# EAGLE design M7103 (EAGLE 6.6.0)
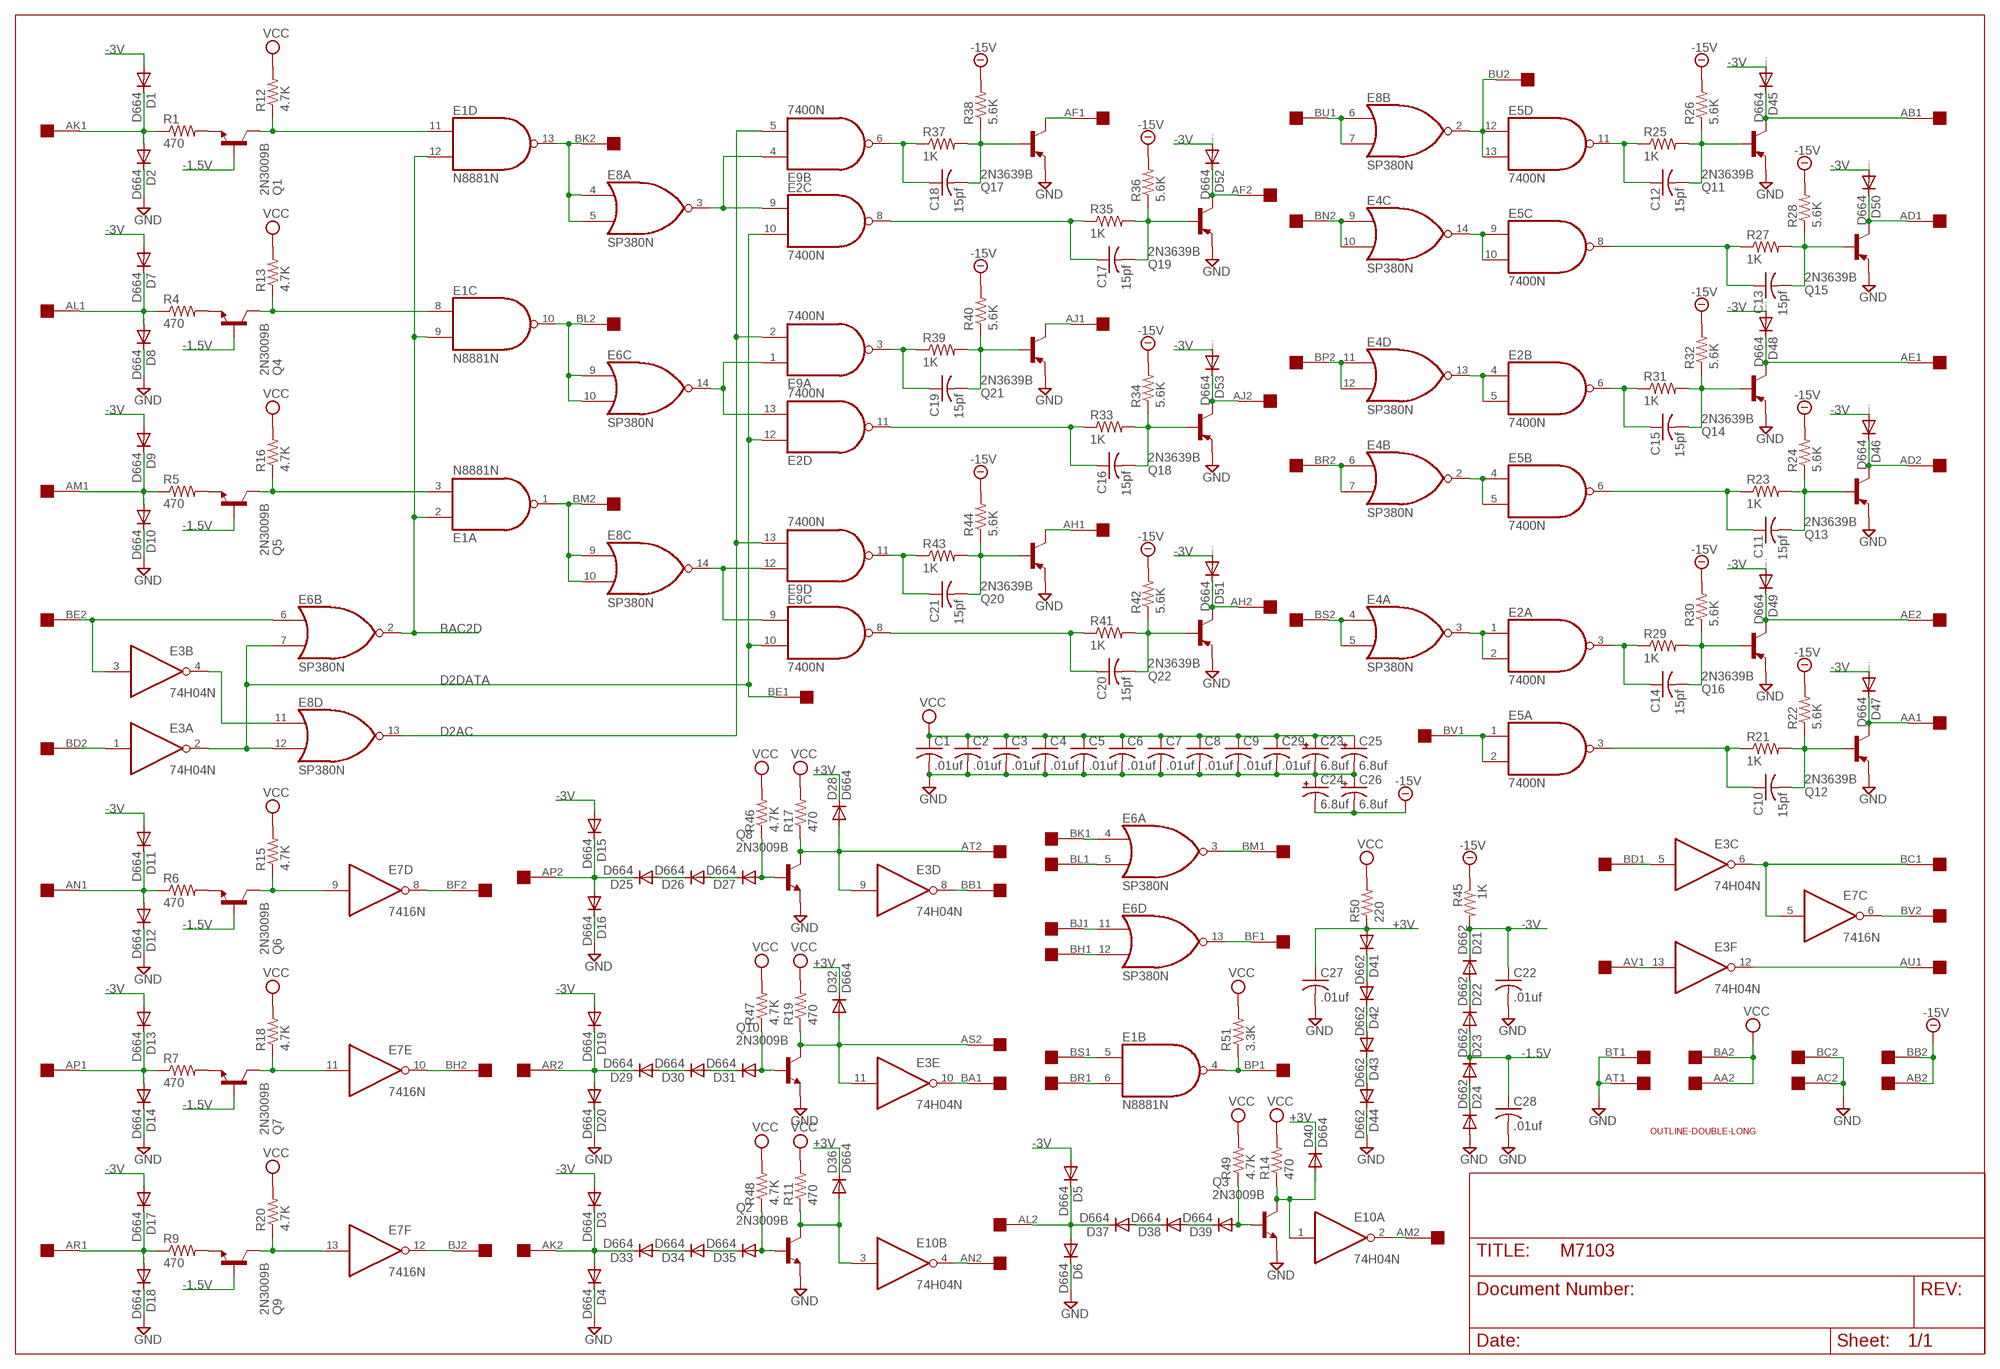
[diagram p0: schematic, sheet 1]

## Parts
C1  .01uf  C-US050-025X075  [C050-025X075]
C2  .01uf  C-US050-025X075  [C050-025X075]
C3  .01uf  C-US050-025X075  [C050-025X075]
C4  .01uf  C-US050-025X075  [C050-025X075]
C5  .01uf  C-US050-025X075  [C050-025X075]
C6  .01uf  C-US050-025X075  [C050-025X075]
C7  .01uf  C-US050-025X075  [C050-025X075]
C8  .01uf  C-US050-025X075  [C050-025X075]
C9  .01uf  C-US050-025X075  [C050-025X075]
C10  15pf  C-US050-025X075  [C050-025X075]
C11  15pf  C-US050-025X075  [C050-025X075]
C12  15pf  C-US050-025X075  [C050-025X075]
C13  15pf  C-US050-025X075  [C050-025X075]
C14  15pf  C-US050-025X075  [C050-025X075]
C15  15pf  C-US050-025X075  [C050-025X075]
C16  15pf  C-US050-025X075  [C050-025X075]
C17  15pf  C-US050-025X075  [C050-025X075]
C18  15pf  C-US050-025X075  [C050-025X075]
C19  15pf  C-US050-025X075  [C050-025X075]
C20  15pf  C-US050-025X075  [C050-025X075]
C21  15pf  C-US050-025X075  [C050-025X075]
C22  .01uf  C-US050-025X075  [C050-025X075]
C23  6.8uf  CPOL-USE15-5AXIAL  [E15-5]
C24  6.8uf  CPOL-USE15-5AXIAL  [E15-5]
C25  6.8uf  CPOL-USE15-5AXIAL  [E15-5]
C26  6.8uf  CPOL-USE15-5AXIAL  [E15-5]
C27  .01uf  C-US050-025X075  [C050-025X075]
C28  .01uf  C-US050-025X075  [C050-025X075]
C29  .01uf  C-US050-025X075  [C050-025X075]
D1  D664  1N4148DO35-10  [DO35-10]
D2  D664  1N4148DO35-10  [DO35-10]
D3  D664  1N4148DO35-10  [DO35-10]
D4  D664  1N4148DO35-10  [DO35-10]
D5  D664  1N4148DO35-10  [DO35-10]
D6  D664  1N4148DO35-10  [DO35-10]
D7  D664  1N4148DO35-10  [DO35-10]
D8  D664  1N4148DO35-10  [DO35-10]
D9  D664  1N4148DO35-10  [DO35-10]
D10  D664  1N4148DO35-10  [DO35-10]
D11  D664  1N4148DO35-10  [DO35-10]
D12  D664  1N4148DO35-10  [DO35-10]
D13  D664  1N4148DO35-10  [DO35-10]
D14  D664  1N4148DO35-10  [DO35-10]
D15  D664  1N4148DO35-10  [DO35-10]
D16  D664  1N4148DO35-10  [DO35-10]
D17  D664  1N4148DO35-10  [DO35-10]
D18  D664  1N4148DO35-10  [DO35-10]
D19  D664  1N4148DO35-10  [DO35-10]
D20  D664  1N4148DO35-10  [DO35-10]
D21  D662  1N4148DO35-10  [DO35-10]
D22  D662  1N4148DO35-10  [DO35-10]
D23  D662  1N4148DO35-10  [DO35-10]
D24  D662  1N4148DO35-10  [DO35-10]
D25  D664  1N4148DO35-10  [DO35-10]
D26  D664  1N4148DO35-10  [DO35-10]
D27  D664  1N4148DO35-10  [DO35-10]
D28  D664  1N4148DO35-10  [DO35-10]
D29  D664  1N4148DO35-10  [DO35-10]
D30  D664  1N4148DO35-10  [DO35-10]
D31  D664  1N4148DO35-10  [DO35-10]
D32  D664  1N4148DO35-10  [DO35-10]
D33  D664  1N4148DO35-10  [DO35-10]
D34  D664  1N4148DO35-10  [DO35-10]
D35  D664  1N4148DO35-10  [DO35-10]
D36  D664  1N4148DO35-10  [DO35-10]
D37  D664  1N4148DO35-10  [DO35-10]
D38  D664  1N4148DO35-10  [DO35-10]
D39  D664  1N4148DO35-10  [DO35-10]
D40  D664  1N4148DO35-10  [DO35-10]
D41  D662  1N4148DO35-10  [DO35-10]
D42  D662  1N4148DO35-10  [DO35-10]
D43  D662  1N4148DO35-10  [DO35-10]
D44  D662  1N4148DO35-10  [DO35-10]
D45  D664  1N4148DO35-10  [DO35-10]
D46  D664  1N4148DO35-10  [DO35-10]
D47  D664  1N4148DO35-10  [DO35-10]
D48  D664  1N4148DO35-10  [DO35-10]
D49  D664  1N4148DO35-10  [DO35-10]
D50  D664  1N4148DO35-10  [DO35-10]
D51  D664  1N4148DO35-10  [DO35-10]
D52  D664  1N4148DO35-10  [DO35-10]
D53  D664  1N4148DO35-10  [DO35-10]
E1  N8881N  [DIL14]
E2  7400N  [DIL14]
E3  74H04N  7404N  [DIL14]
E4  SP380N  [DIL14]
E5  7400N  [DIL14]
E6  SP380N  [DIL14]
E7  7416N  [DIL14]
E8  SP380N  [DIL14]
E9  7400N  [DIL14]
E10  74H04N  7404N  [DIL14]
EDGE  DOUBLE  [EDGE-CON4]
Q1  2N3009B  2N3019  [TO39]
Q2  2N3009B  2N3019  [TO39]
Q3  2N3009B  2N3019  [TO39]
Q4  2N3009B  2N3019  [TO39]
Q5  2N3009B  2N3019  [TO39]
Q6  2N3009B  2N3019  [TO39]
Q7  2N3009B  2N3019  [TO39]
Q8  2N3009B  2N3019  [TO39]
Q9  2N3009B  2N3019  [TO39]
Q10  2N3009B  2N3019  [TO39]
Q11  2N3639B  2N3637  [TO39]
Q12  2N3639B  2N3637  [TO39]
Q13  2N3639B  2N3637  [TO39]
Q14  2N3639B  2N3637  [TO39]
Q15  2N3639B  2N3637  [TO39]
Q16  2N3639B  2N3637  [TO39]
Q17  2N3639B  2N3637  [TO39]
Q18  2N3639B  2N3637  [TO39]
Q19  2N3639B  2N3637  [TO39]
Q20  2N3639B  2N3637  [TO39]
Q21  2N3639B  2N3637  [TO39]
Q22  2N3639B  2N3637  [TO39]
R1  470  R-US_0207/10  [0207/10]
R4  470  R-US_0207/10  [0207/10]
R5  470  R-US_0207/10  [0207/10]
R6  470  R-US_0207/10  [0207/10]
R7  470  R-US_0207/10  [0207/10]
R9  470  R-US_0207/10  [0207/10]
R11  470  R-US_0207/10  [0207/10]
R12  4.7K  R-US_0207/10  [0207/10]
R13  4.7K  R-US_0207/10  [0207/10]
R14  470  R-US_0207/10  [0207/10]
R15  4.7K  R-US_0207/10  [0207/10]
R16  4.7K  R-US_0207/10  [0207/10]
R17  470  R-US_0207/10  [0207/10]
R18  4.7K  R-US_0207/10  [0207/10]
R19  470  R-US_0207/10  [0207/10]
R20  4.7K  R-US_0207/10  [0207/10]
R21  1K  R-US_0207/10  [0207/10]
R22  5.6K  R-US_0207/10  [0207/10]
R23  1K  R-US_0207/10  [0207/10]
R24  5.6K  R-US_0207/10  [0207/10]
R25  1K  R-US_0207/10  [0207/10]
R26  5.6K  R-US_0207/10  [0207/10]
R27  1K  R-US_0207/10  [0207/10]
R28  5.6K  R-US_0207/10  [0207/10]
R29  1K  R-US_0207/10  [0207/10]
R30  5.6K  R-US_0207/10  [0207/10]
R31  1K  R-US_0207/10  [0207/10]
R32  5.6K  R-US_0207/10  [0207/10]
R33  1K  R-US_0207/10  [0207/10]
R34  5.6K  R-US_0207/10  [0207/10]
R35  1K  R-US_0207/10  [0207/10]
R36  5.6K  R-US_0207/10  [0207/10]
R37  1K  R-US_0207/10  [0207/10]
R38  5.6K  R-US_0207/10  [0207/10]
R39  1K  R-US_0207/10  [0207/10]
R40  5.6K  R-US_0207/10  [0207/10]
R41  1K  R-US_0207/10  [0207/10]
R42  5.6K  R-US_0207/10  [0207/10]
R43  1K  R-US_0207/10  [0207/10]
R44  5.6K  R-US_0207/10  [0207/10]
R45  1K  R-US_0207/10  [0207/10]
R46  4.7K  R-US_0207/10  [0207/10]
R47  4.7K  R-US_0207/10  [0207/10]
R48  4.7K  R-US_0207/10  [0207/10]
R49  4.7K  R-US_0207/10  [0207/10]
R50  220  R-US_0207/10  [0207/10]
R51  3.3K  R-US_0207/10  [0207/10]
U$3  OUTLINE-DOUBLE-LONG  [DOUBLE-LONG]

## Nets
+3V [Supply]: C27.1 D28.C D32.C D36.C D40.C D41.A R50.1
-1.5V [Supply]: C28.1 D22.A D23.C Q1.2(B) Q4.2(B) Q5.2(B) Q6.2(B) Q7.2(B) Q9.2(B)
-3V [Supply]: C22.1 D1.A D3.A D5.A D7.A D9.A D11.A D13.A D15.A D17.A D19.A D21.C D45.A D46.A D47.A D48.A D49.A D50.A D51.A D52.A D53.A R45.2
-15V [Supply]: C24.- C26.- EDGE.AB2 EDGE.BB2 R22.2 R24.2 R26.2 R28.2 R30.2 R32.2 R34.2 R36.2 R38.2 R40.2 R42.2 R44.2 R45.1
AK1: D1.C D2.A EDGE.AK1 R1.1
AL1: D7.C D8.A EDGE.AL1 R4.1
AM1: D9.C D10.A EDGE.AM1 R5.1
AN1: D11.C D12.A EDGE.AN1 R6.1
AP1: D13.C D14.A EDGE.AP1 R7.1
AR1: D17.C D18.A EDGE.AR1 R9.1
BAC2D: E1.2(A:I0) E1.9(C:I1) E1.12(D:I1) E6.2(B:O)
BD2: E3.1(A:I) EDGE.BD2
BE2: E3.3(B:I) E6.6(B:I0) EDGE.BE2
D2AC: E8.13(D:O) E9.2(A:I1) E9.5(B:I1) E9.13(D:I1)
D2DATA: E2.10(C:I1) E2.12(D:I0) E3.2(A:O) E6.7(B:I1) E8.12(D:I1) E9.10(C:I1) EDGE.BE1
GND [Supply]: C1.2 C2.2 C3.2 C4.2 C5.2 C6.2 C7.2 C8.2 C9.2 C22.2 C23.- C24.+ C25.- C26.+ C27.2 C28.2 C29.2 D2.C D4.C D6.C D8.C D10.C D12.C D14.C D16.C D18.C D20.C D24.A D44.C EDGE.AC2 EDGE.AT1 EDGE.BC2 EDGE.BT1 Q2.1(E) Q3.1(E) Q8.1(E) Q10.1(E) Q11.1(E) Q12.1(E) Q13.1(E) Q14.1(E) Q15.1(E) Q16.1(E) Q17.1(E) Q18.1(E) Q19.1(E) Q20.1(E) Q21.1(E) Q22.1(E)
N$1: Q4.1(E) R4.2
N$2: E1.8(C:I0) Q4.3(C) R13.1
N$3: Q1.1(E) R1.2
N$4: Q5.1(E) R5.2
N$5: E1.11(D:I0) Q1.3(C) R12.1
N$6: E1.3(A:I1) Q5.3(C) R16.1
N$7: Q6.1(E) R6.2
N$8: E7.9(D:I) Q6.3(C) R15.1
N$9: Q7.1(E) R7.2
N$10: E7.11(E:I) Q7.3(C) R18.1
N$11: Q9.1(E) R9.2
N$12: E7.13(F:I) Q9.3(C) R20.1
N$13: E3.4(B:O) E8.11(D:I0)
N$14: D15.C D16.A D25.C EDGE.AP2
N$15: E1.1(A:O) E8.9(C:I0) E8.10(C:I1) EDGE.BM2
N$16: E1.10(C:O) E6.9(C:I0) E6.10(C:I1) EDGE.BL2
N$17: E1.13(D:O) E8.4(A:I0) E8.5(A:I1) EDGE.BK2
N$18: E7.12(F:O) EDGE.BJ2
N$19: E7.10(E:O) EDGE.BH2
N$20: E7.8(D:O) EDGE.BF2
N$21: E2.9(C:I0) E8.3(A:O) E9.4(B:I0)
N$22: E2.13(D:I1) E6.14(C:O) E9.1(A:I0)
N$23: E8.14(C:O) E9.9(C:I0) E9.12(D:I0)
N$24: D27.A Q8.2(B) R46.1
N$25: D25.A D26.C
N$26: C18.1 E9.6(B:O) R37.1
N$27: C18.2 Q17.2(B) R37.2 R38.1
N$28: EDGE.AF1 Q17.3(C)
N$29: C17.1 E2.8(C:O) R35.1
N$30: C17.2 Q19.2(B) R35.2 R36.1
N$31: D52.C EDGE.AF2 Q19.3(C)
N$32: C12.1 E5.11(D:O) R25.1
N$33: C12.2 Q11.2(B) R25.2 R26.1
N$34: D45.C EDGE.AB1 Q11.3(C)
N$35: C13.1 E5.8(C:O) R27.1
N$36: C13.2 Q15.2(B) R27.2 R28.1
N$37: D50.C EDGE.AD1 Q15.3(C)
N$38: E5.12(D:I0) E5.13(D:I1) E8.2(B:O) EDGE.BU2
N$39: E4.14(C:O) E5.9(C:I0) E5.10(C:I1)
N$40: E8.6(B:I0) E8.7(B:I1) EDGE.BU1
N$41: E4.9(C:I0) E4.10(C:I1) EDGE.BN2
N$42: C19.1 E9.3(A:O) R39.1
N$43: C19.2 Q21.2(B) R39.2 R40.1
N$44: EDGE.AJ1 Q21.3(C)
N$45: C16.1 E2.11(D:O) R33.1
N$46: C16.2 Q18.2(B) R33.2 R34.1
N$47: D53.C EDGE.AJ2 Q18.3(C)
N$48: C21.1 E9.11(D:O) R43.1
N$49: C21.2 Q20.2(B) R43.2 R44.1
N$50: EDGE.AH1 Q20.3(C)
N$51: C20.1 E9.8(C:O) R41.1
N$52: C20.2 Q22.2(B) R41.2 R42.1
N$53: D51.C EDGE.AH2 Q22.3(C)
N$54: C15.1 E2.6(B:O) R31.1
N$55: C15.2 Q14.2(B) R31.2 R32.1
N$56: D48.C EDGE.AE1 Q14.3(C)
N$57: C11.1 E5.6(B:O) R23.1
N$58: C11.2 Q13.2(B) R23.2 R24.1
N$59: D46.C EDGE.AD2 Q13.3(C)
N$60: C14.1 E2.3(A:O) R29.1
N$61: C14.2 Q16.2(B) R29.2 R30.1
N$62: D49.C EDGE.AE2 Q16.3(C)
N$63: C10.1 E5.3(A:O) R21.1
N$64: C10.2 Q12.2(B) R21.2 R22.1
N$65: D47.C EDGE.AA1 Q12.3(C)
N$66: E2.4(B:I0) E2.5(B:I1) E4.13(D:O)
N$67: E4.2(B:O) E5.4(B:I0) E5.5(B:I1)
N$68: E5.1(A:I0) E5.2(A:I1) EDGE.BV1
N$69: E2.1(A:I0) E2.2(A:I1) E4.3(A:O)
N$70: E4.4(A:I0) E4.5(A:I1) EDGE.BS2
N$71: E4.6(B:I0) E4.7(B:I1) EDGE.BR2
N$72: E4.11(D:I0) E4.12(D:I1) EDGE.BP2
N$73: D26.A D27.C
N$74: D28.A E3.9(D:I) EDGE.AT2 Q8.3(C) R17.1
N$75: D31.A Q10.2(B) R47.1
N$76: D29.A D30.C
N$77: D30.A D31.C
N$78: D32.A E3.11(E:I) EDGE.AS2 Q10.3(C) R19.1
N$79: D35.A Q2.2(B) R48.1
N$80: D33.A D34.C
N$81: D34.A D35.C
N$82: D36.A E10.3(B:I) Q2.3(C) R11.1
N$83: D39.A Q3.2(B) R49.1
N$84: D37.A D38.C
N$85: D38.A D39.C
N$86: D40.A E10.1(A:I) Q3.3(C) R14.1
N$87: E10.4(B:O) EDGE.AN2
N$88: E3.8(D:O) EDGE.BB1
N$89: E3.10(E:O) EDGE.BA1
N$90: E10.2(A:O) EDGE.AM2
N$91: E6.5(A:I1) EDGE.BL1
N$92: E6.4(A:I0) EDGE.BK1
N$93: E6.3(A:O) EDGE.BM1
N$94: E6.13(D:O) EDGE.BF1
N$95: E6.12(D:I1) EDGE.BH1
N$96: E6.11(D:I0) EDGE.BJ1
N$97: E1.5(B:I0) EDGE.BS1
N$98: E1.6(B:I1) EDGE.BR1
N$99: E1.4(B:O) EDGE.BP1 R51.1
N$100: E3.6(C:O) E7.5(C:I) EDGE.BC1
N$101: E3.5(C:I) EDGE.BD1
N$102: E3.13(F:I) EDGE.AV1
N$103: E3.12(F:O) EDGE.AU1
N$104: E7.6(C:O) EDGE.BV2
N$105: D23.A D24.C
N$106: D3.C D4.A D33.C EDGE.AK2
N$107: D41.C D42.A
N$108: D42.C D43.A
N$109: D43.C D44.A
N$110: D21.A D22.C
N$111: D19.C D20.A D29.C EDGE.AR2
N$112: D5.C D6.A D37.C EDGE.AL2
VCC [Supply]: C1.1 C2.1 C3.1 C4.1 C5.1 C6.1 C7.1 C8.1 C9.1 C23.+ C25.+ C29.1 EDGE.AA2 EDGE.BA2 R11.2 R12.2 R13.2 R14.2 R15.2 R16.2 R17.2 R18.2 R19.2 R20.2 R46.2 R47.2 R48.2 R49.2 R50.2 R51.2
Unconnected: E7.1(A:I) E7.2(A:O) E7.3(B:I) E7.4(B:O) E10.5(C:I) E10.6(C:O) E10.8(D:O) E10.9(D:I) E10.10(E:O) E10.11(E:I) E10.12(F:O) E10.13(F:I) EDGE.AC1 EDGE.AS1 EDGE.AU2 EDGE.AV2 EDGE.BN1 EDGE.BT2

## Power pins joined to a net without a drawn wire
GND: E1.7(P:GND) E2.7(P:GND) E3.7(P:GND) E4.1(P:GND) E5.7(P:GND) E6.1(P:GND) E7.7(P:GND) E8.1(P:GND) E9.7(P:GND) E10.7(P:GND)
VCC: E1.14(P:VCC) E2.14(P:VCC) E3.14(P:VCC) E4.8(P:VCC) E5.14(P:VCC) E6.8(P:VCC) E7.14(P:VCC) E8.8(P:VCC) E9.14(P:VCC) E10.14(P:VCC)

## Library data of the parts
C1-C22 C27-C29 = rcl:C-US: CAPACITOR, American symbol
C23-C26 = rcl:CPOL-US: POLARIZED CAPACITOR, American symbol
D1-D53 = diode:1N4148: DIODE high speed (Philips)
E1 = dec-con:N8881: Quad 2-input NAND gate, open collector
E2 E5 E9 = 74xx-us:74*00: Quad 2-input NAND gate
E3 E10 = 74xx-us:74*04: Hex INVERTER
E4 E6 E8 = dec-con:SP380: Quad NOR gate (use 8640)
E7 = 74xx-us:74*16: Hex INVERTER, open collector, high-voltage
EDGE = dec-con:DOUBLE: Double-Height DEC board
Q1-Q10 = transistor-npn:2N3019: NPN Transistor
Q11-Q22 = transistor-pnp:2N3637*: PNP Transistror
R1 R4-R7 R9 R11-R51 = rcl:R-US_: RESISTOR, American symbol
U$3 = dec-con:OUTLINE-*: Board outlines for DEC boards.

## Net classes
1 Supply: width 0.635 mm

## Board
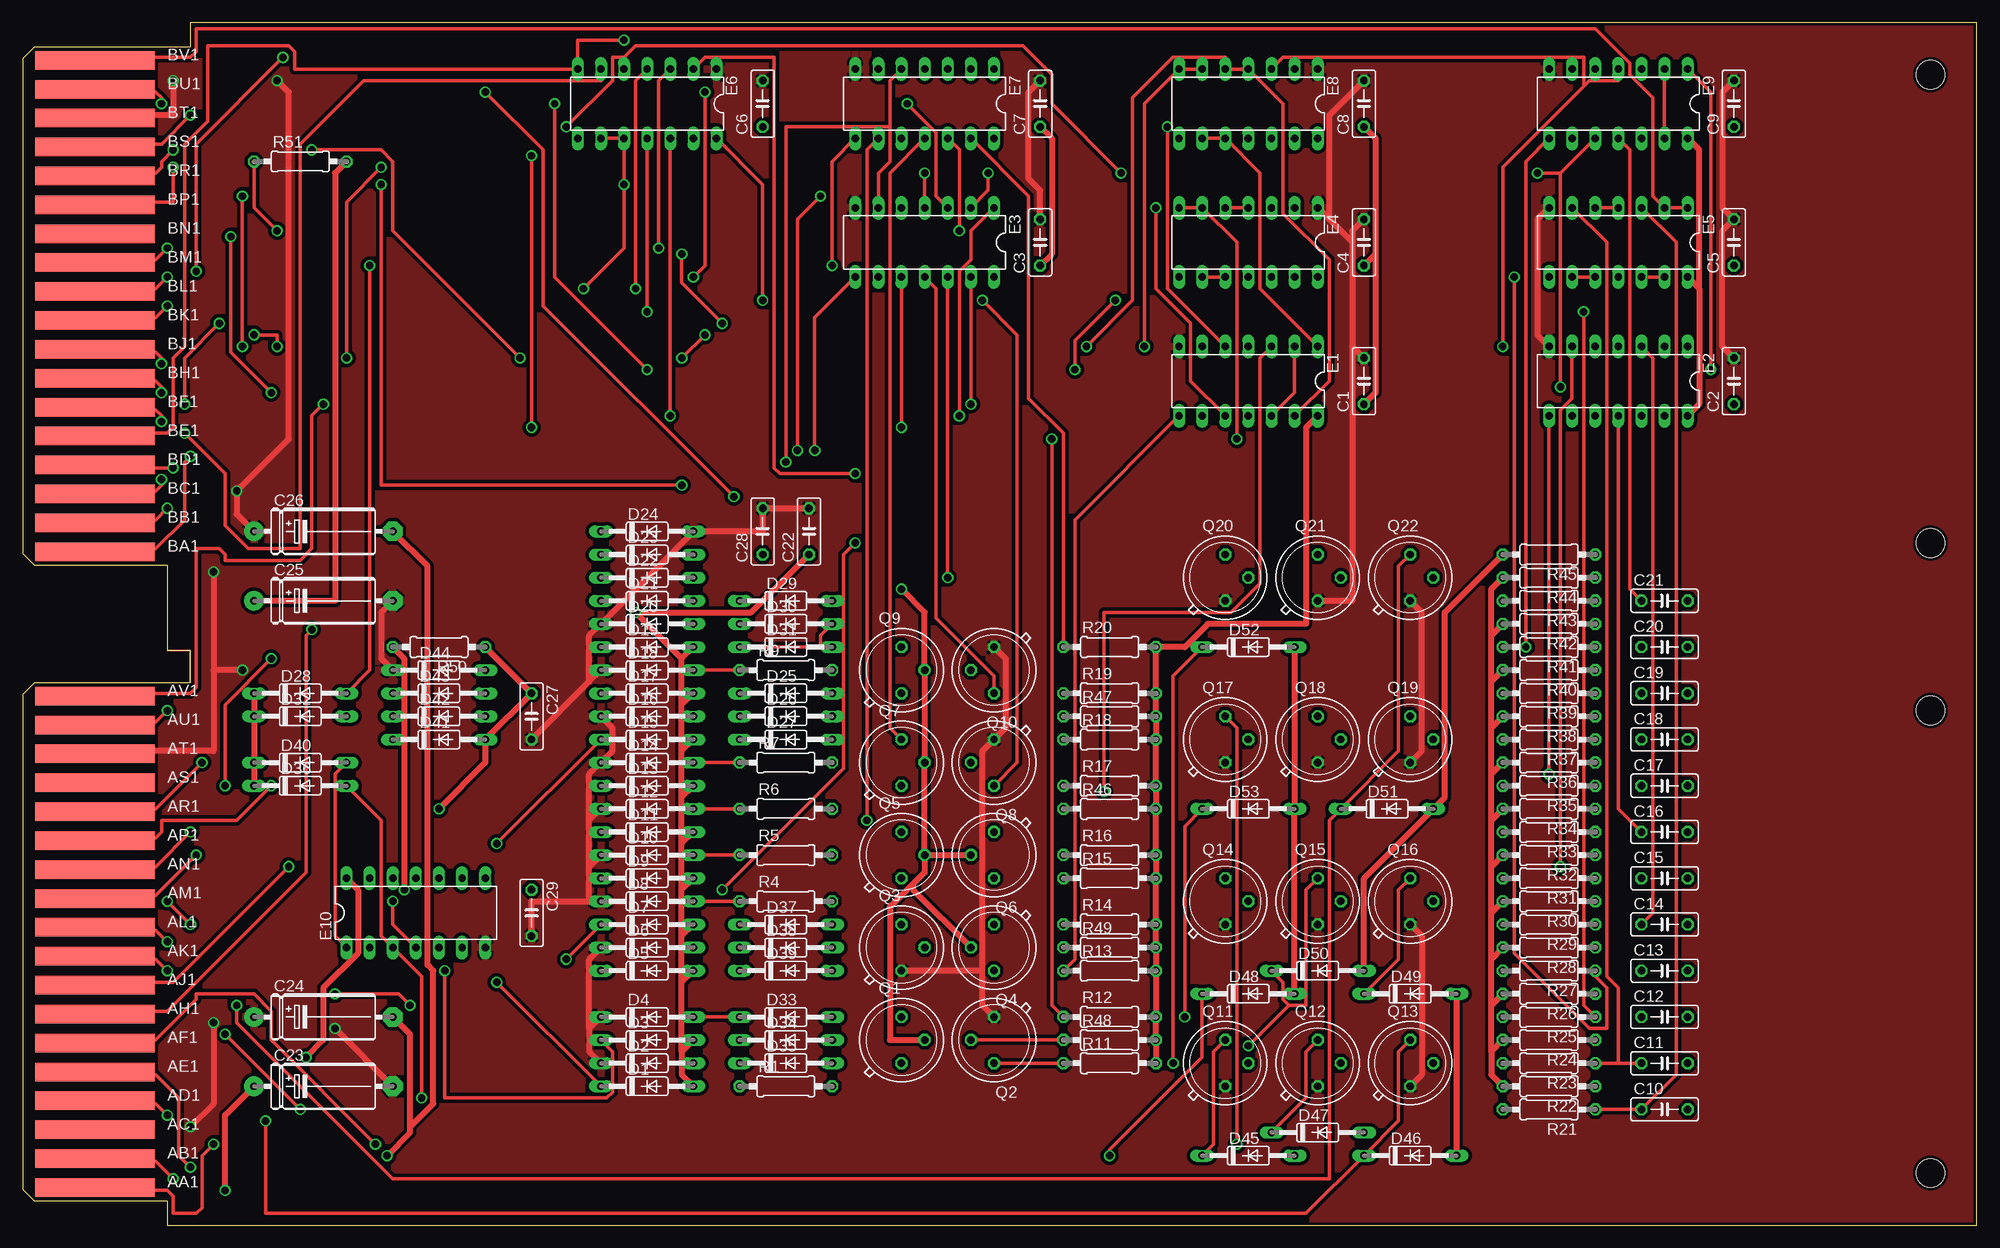
[diagram p1: board, top side]
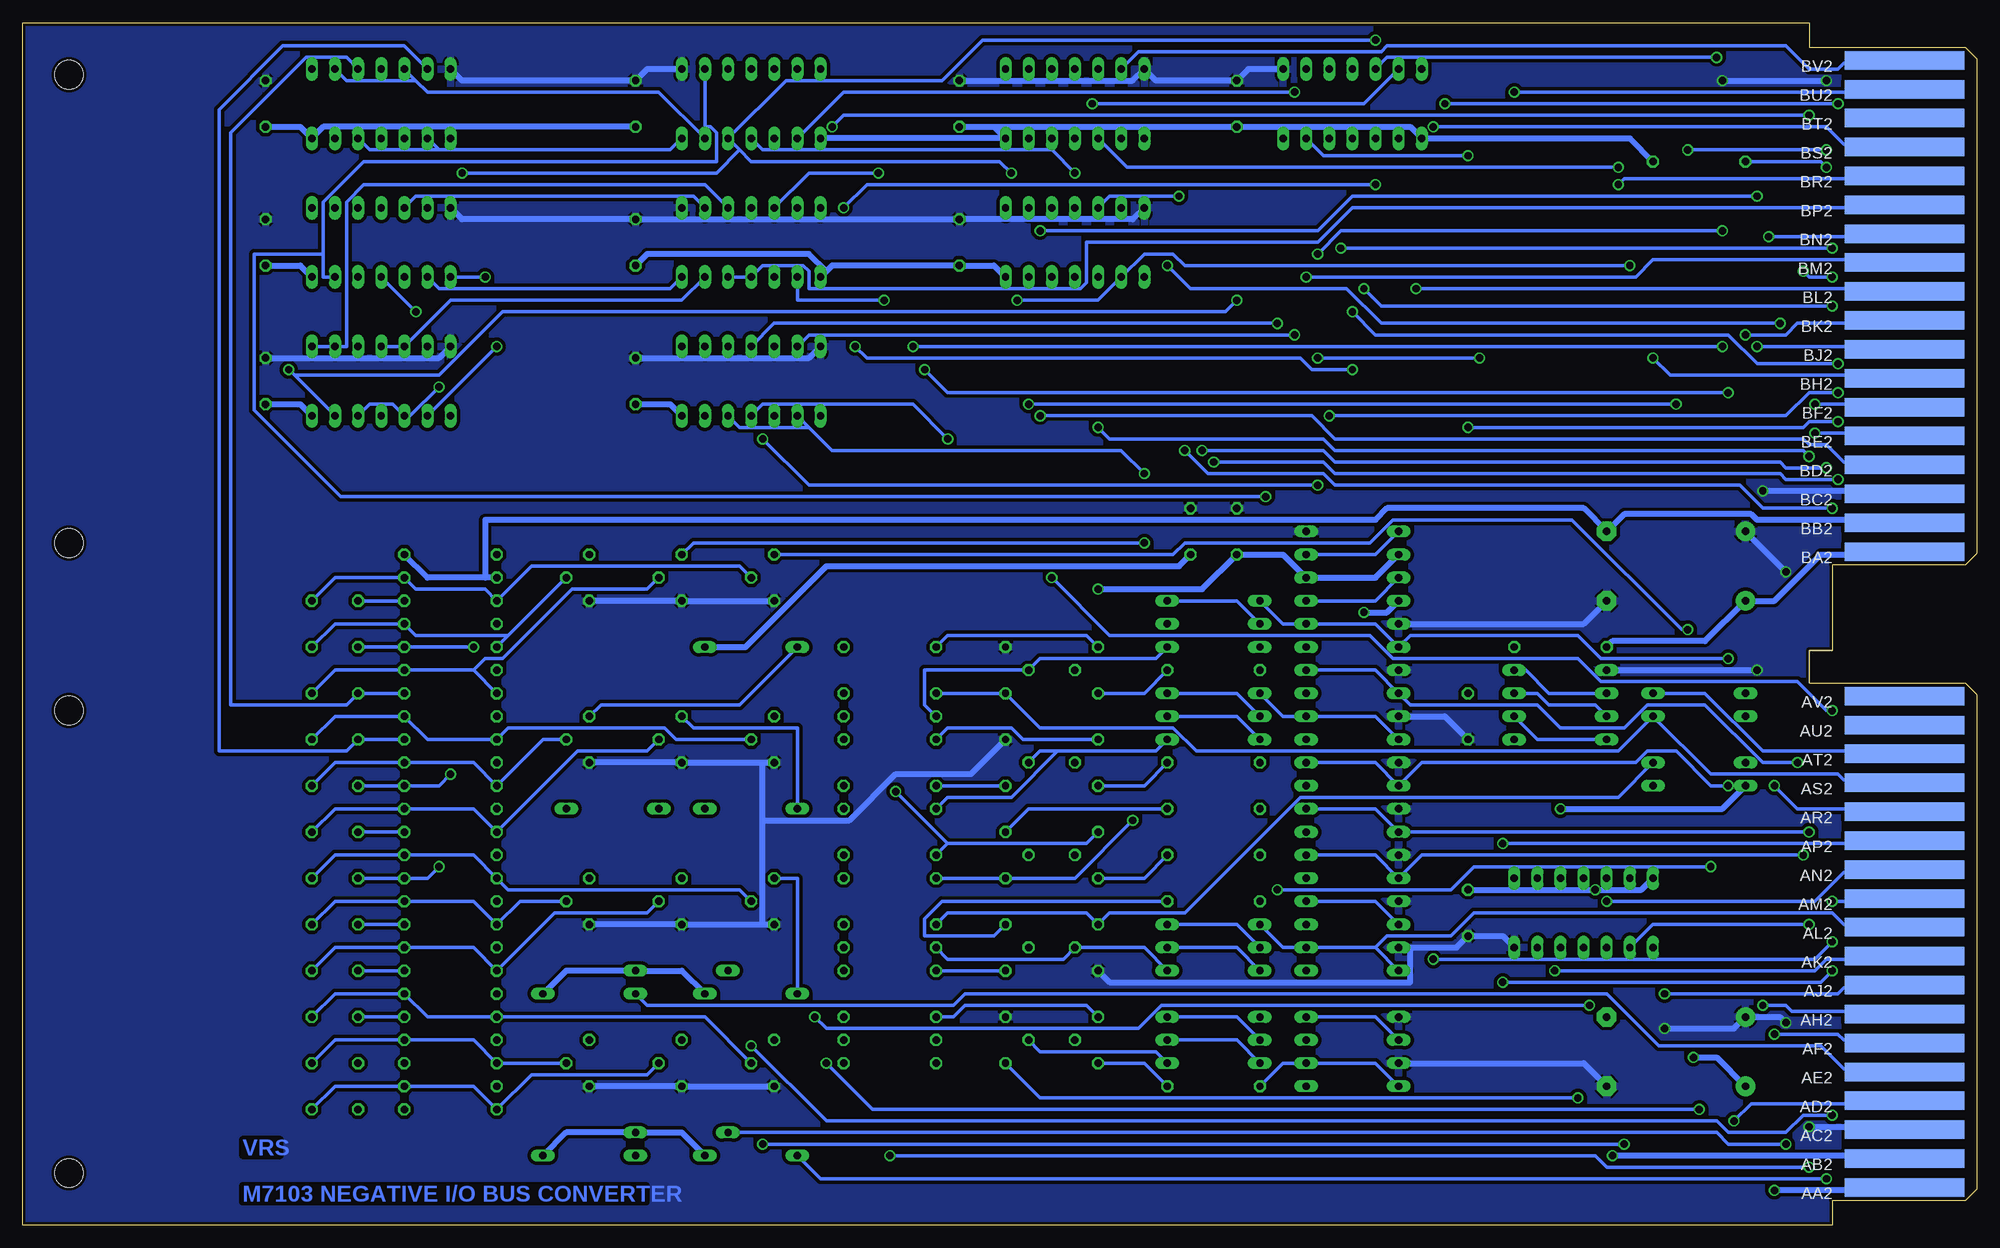
[diagram p2: board, bottom side, seen from below]

Size 214.63 x 132.08 mm. Coordinates in mm from the lower left corner, seen from the top.
Copper layers (1+16): Top 0.035mm / dielectric 1.5mm / Bottom 0.035mm
Design rules "16mils": minimum track width 16mil, minimum drill 32mil, track to track 15mil, track to pad 10mil, pad to pad 10mil, via to via 10mil, smd to smd 10mil, copper to edge 13mil, drill to drill 10mil, minimum pad ring 10mil, minimum via ring 8mil, stop-mask expansion 0mil, vias tented up to drill 0mil, thermal gap 10mil

### Footprints (pad centres in the part's own frame; a part is rotated, then mirrored left to right if it is on the bottom)
C050-025X075 = drill 0.813 octagon: 1 -2.54,0; 2 2.54,0
E15-5 = drill 0.813 pad 2.159: + -7.62,0 | drill 0.813 pad 2.159 octagon: - 7.62,0
DO35-10 = drill 0.813 long: A 5.08,0; C -5.08,0
DIL14 = drill 0.813 long: 1 -7.62,-3.81; 2 -5.08,-3.81; 3 -2.54,-3.81; 4 0,-3.81; 5 2.54,-3.81; 6 5.08,-3.81; 7 7.62,-3.81; 8 7.62,3.81; 9 5.08,3.81; 10 2.54,3.81; 11 0,3.81; 12 -2.54,3.81; 13 -5.08,3.81; 14 -7.62,3.81
EDGE-CON4 = smd 13.106 x 2.032: AA1 7.938,4.128; AB1 7.938,7.303; AC1 7.938,10.477; AD1 7.938,13.652; AE1 7.938,16.828; AF1 7.938,20.003; AH1 7.938,23.177; AJ1 7.938,26.352; AK1 7.938,29.527; AL1 7.938,32.703; AM1 7.938,35.877; AN1 7.938,39.053; AP1 7.938,42.227; AR1 7.938,45.403; AS1 7.938,48.578; AT1 7.938,51.752; AU1 7.938,54.928; AV1 7.938,58.102; BA1 7.938,73.978; BB1 7.938,77.153; BC1 7.938,80.328; BD1 7.938,83.502; BE1 7.938,86.677; BF1 7.938,89.853; BH1 7.938,93.028; BJ1 7.938,96.203; BK1 7.938,99.377; BL1 7.938,102.552; BM1 7.938,105.728; BN1 7.938,108.903; BP1 7.938,112.078; BR1 7.938,115.252; BS1 7.938,118.427; BT1 7.938,121.603; BU1 7.938,124.778; BV1 7.938,127.953 | smd 13.106 x 2.032 bottom: AA2 7.938,4.128; AB2 7.938,7.303; AC2 7.938,10.477; AD2 7.938,13.652; AE2 7.938,16.828; AF2 7.938,20.003; AH2 7.938,23.177; AJ2 7.938,26.352; AK2 7.938,29.527; AL2 7.938,32.703; AM2 7.938,35.877; AN2 7.938,39.053; AP2 7.938,42.227; AR2 7.938,45.403; AS2 7.938,48.578; AT2 7.938,51.752; AU2 7.938,54.928; AV2 7.938,58.102; BA2 7.938,73.978; BB2 7.938,77.153; BC2 7.938,80.328; BD2 7.938,83.502; BE2 7.938,86.677; BF2 7.938,89.853; BH2 7.938,93.028; BJ2 7.938,96.203; BK2 7.938,99.377; BL2 7.938,102.552; BM2 7.938,105.728; BN2 7.938,108.903; BP2 7.938,112.078; BR2 7.938,115.252; BS2 7.938,118.427; BT2 7.938,121.603; BU2 7.938,124.778; BV2 7.938,127.953
TO39 = drill 0.813 octagon: 1 0,-2.54; 2 2.54,0; 3 0,2.54
0207/10 = drill 0.813 octagon: 1 -5.08,0; 2 5.08,0
DOUBLE-LONG = hole 3.175: 209.55,56.515; 209.55,5.715; 209.55,74.93; 209.55,126.365

### Placement (x,y rotation side)
C1  147.32,92.71 90 top
C2  187.96,92.71 90 top
C3  111.76,107.95 90 top
C4  147.32,107.95 90 top
C5  187.96,107.95 90 top
C6  81.28,123.19 90 top
C7  111.76,123.19 90 top
C8  147.32,123.19 90 top
C9  187.96,123.19 90 top
C10  180.34,12.7 0 top
C11  180.34,17.78 0 top
C12  180.34,22.86 0 top
C13  180.34,27.94 0 top
C14  180.34,33.02 0 top
C15  180.34,38.1 0 top
C16  180.34,43.18 0 top
C17  180.34,48.26 0 top
C18  180.34,53.34 0 top
C19  180.34,58.42 0 top
C20  180.34,63.5 0 top
C21  180.34,68.58 0 top
C22  86.36,76.2 90 top
C23  33.02,15.24 0 top
C24  33.02,22.86 0 top
C25  33.02,68.58 0 top
C26  33.02,76.2 0 top
C27  55.88,55.88 270 top
C28  81.28,76.2 90 top
C29  55.88,34.29 270 top
D1  68.58,15.24 0 top
D2  68.58,17.78 0 top
D3  68.58,20.32 0 top
D4  68.58,22.86 0 top
D5  68.58,27.94 0 top
D6  68.58,30.48 0 top
D7  68.58,33.02 0 top
D8  68.58,35.56 0 top
D9  68.58,38.1 0 top
D10  68.58,40.64 0 top
D11  68.58,43.18 0 top
D12  68.58,45.72 0 top
D13  68.58,48.26 0 top
D14  68.58,50.8 0 top
D15  68.58,53.34 0 top
D16  68.58,55.88 0 top
D17  68.58,58.42 0 top
D18  68.58,60.96 0 top
D19  68.58,63.5 0 top
D20  68.58,66.04 0 top
D21  68.58,68.58 0 top
D22  68.58,71.12 0 top
D23  68.58,73.66 0 top
D24  68.58,76.2 0 top
D25  83.82,58.42 0 top
D26  83.82,55.88 0 top
D27  83.82,53.34 0 top
D28  30.48,58.42 0 top
D29  83.82,68.58 0 top
D30  83.82,66.04 0 top
D31  83.82,63.5 0 top
D32  30.48,55.88 0 top
D33  83.82,22.86 0 top
D34  83.82,20.32 0 top
D35  83.82,17.78 0 top
D36  30.48,48.26 0 top
D37  83.82,33.02 0 top
D38  83.82,30.48 0 top
D39  83.82,27.94 0 top
D40  30.48,50.8 0 top
D41  45.72,53.34 0 top
D42  45.72,55.88 0 top
D43  45.72,58.42 0 top
D44  45.72,60.96 0 top
D45  134.62,7.62 0 top
D46  152.4,7.62 0 top
D47  142.24,10.16 0 top
D48  134.62,25.4 0 top
D49  152.4,25.4 0 top
D50  142.24,27.94 0 top
D51  149.86,45.72 0 top
D52  134.62,63.5 0 top
D53  134.62,45.72 0 top
E1  134.62,92.71 180 top
E2  175.26,92.71 180 top
E3  99.06,107.95 180 top
E4  134.62,107.95 180 top
E5  175.26,107.95 180 top
E6  68.58,123.19 180 top
E7  99.06,123.19 180 top
E8  134.62,123.19 180 top
E9  175.26,123.19 180 top
E10  43.18,34.29 0 top
EDGE  0,0 0 top
Q1  96.52,20.32 0 top
Q2  106.68,20.32 180 top
Q3  96.52,30.48 0 top
Q4  106.68,30.48 180 top
Q5  96.52,40.64 0 top
Q6  106.68,40.64 180 top
Q7  96.52,50.8 0 top
Q8  106.68,50.8 180 top
Q9  96.52,60.96 0 top
Q10  106.68,60.96 180 top
Q11  132.08,17.78 0 top
Q12  142.24,17.78 0 top
Q13  152.4,17.78 0 top
Q14  132.08,35.56 0 top
Q15  142.24,35.56 0 top
Q16  152.4,35.56 0 top
Q17  132.08,53.34 0 top
Q18  142.24,53.34 0 top
Q19  152.4,53.34 0 top
Q20  132.08,71.12 0 top
Q21  142.24,71.12 0 top
Q22  152.4,71.12 0 top
R1  83.82,15.24 0 top
R4  83.82,35.56 0 top
R5  83.82,40.64 0 top
R6  83.82,45.72 0 top
R7  83.82,50.8 0 top
R9  83.82,60.96 0 top
R11  119.38,17.78 0 top
R12  119.38,22.86 0 top
R13  119.38,27.94 0 top
R14  119.38,33.02 0 top
R15  119.38,38.1 0 top
R16  119.38,40.64 0 top
R17  119.38,48.26 0 top
R18  119.38,53.34 0 top
R19  119.38,58.42 0 top
R20  119.38,63.5 0 top
R21  167.64,12.7 180 top
R22  167.64,15.24 180 top
R23  167.64,17.78 180 top
R24  167.64,20.32 180 top
R25  167.64,22.86 180 top
R26  167.64,25.4 180 top
R27  167.64,27.94 180 top
R28  167.64,30.48 180 top
R29  167.64,33.02 180 top
R30  167.64,35.56 180 top
R31  167.64,38.1 180 top
R32  167.64,40.64 180 top
R33  167.64,43.18 180 top
R34  167.64,45.72 180 top
R35  167.64,48.26 180 top
R36  167.64,50.8 180 top
R37  167.64,53.34 180 top
R38  167.64,55.88 180 top
R39  167.64,58.42 180 top
R40  167.64,60.96 180 top
R41  167.64,63.5 180 top
R42  167.64,66.04 180 top
R43  167.64,68.58 180 top
R44  167.64,71.12 180 top
R45  167.64,73.66 180 top
R46  119.38,45.72 0 top
R47  119.38,55.88 0 top
R48  119.38,20.32 0 top
R49  119.38,30.48 0 top
R50  45.72,63.5 180 top
R51  30.48,116.84 0 top
U$3  0,0 0 top

### Tracks (layer width: path | path; a pad name or v marks a point on that pad's centre or on a via)
+3V  (via drill 0.81)
  Top 0.635: D36.C D40.C D32.C D28.C | R50.1 C27.1 D41.A 50.8,50.8 v45.72,45.72
  Bottom 0.635: D36.C 27.94,45.72 v45.72,45.72
-1.5V  (via drill 0.81)
  Top 0.635: Q1.2 95.25,20.32 95.25,34.92 97.79,37.47 | 97.79,37.47 99.06,38.73 Q5.2 | Q4.2 97.79,36.83 97.79,37.47 | Q5.2 Q6.2 | Q5.2 Q7.2 Q9.2 99.06,67.31 v96.52,69.85
  Bottom 0.635: D23.C 66.04,71.12 D22.A 76.2,73.66 C28.1 85.09,69.85 v96.52,69.85
-3V  (via drill 0.81)
  Top 0.635: D1.A 72.39,16.51 72.39,19.05 | D3.A 72.39,19.05 | 72.39,26.67 D5.A | 72.39,19.05 72.39,26.67 | 72.39,31.75 D7.A | 72.39,26.67 72.39,31.75 | 72.39,36.83 D9.A | 72.39,31.75 72.39,36.83 | 72.39,41.91 D11.A | 72.39,36.83 72.39,41.91 | 72.39,46.99 D13.A | 72.39,41.91 72.39,46.99 | 72.39,52.07 D15.A | 72.39,46.99 72.39,52.07 | 72.39,57.15 D17.A | 72.39,52.07 72.39,57.15 | 72.39,62.23 D19.A | 72.39,57.15 72.39,62.23 | 72.39,62.23 v67.31,67.31 80.01,67.31 C22.1 | D52.A D53.A D48.A | D50.A 147.32,38.1 D51.A 156.21,46.99 156.21,67.31 R45.2 | D49.A D46.A
  Bottom 0.635: D21.C 64.77,67.31 v67.31,67.31 | D45.A 142.24,10.16 D47.A 154.94,10.16 D46.A | D48.A 142.24,27.94 D50.A 154.94,27.94 D49.A | C22.1 87.63,72.39 126.37,72.39 135.26,63.5 D52.A
-15V  (via drill 0.81)
  Top 0.635: R22.2 161.29,16.51 161.29,19.05 | R24.2 161.29,19.05 | 161.29,24.13 R26.2 | 161.29,19.05 161.29,24.13 | 161.29,29.21 R28.2 | 161.29,24.13 161.29,29.21 | 161.29,34.29 R30.2 | 161.29,29.21 161.29,34.29 | 161.29,39.37 R32.2 | 161.29,34.29 161.29,39.37 | 161.29,44.45 R34.2 | 161.29,39.37 161.29,44.45 | 161.29,49.53 R36.2 | 161.29,44.45 161.29,49.53 | 161.29,54.61 R38.2 | 161.29,49.53 161.29,54.61 | 161.29,59.69 R40.2 | 161.29,54.61 161.29,59.69 | 161.29,64.77 R42.2 | 161.29,59.69 161.29,64.77 | R44.2 161.29,69.85 161.29,64.77 | C24.- 42.55,20.95 42.55,10.79 | 42.55,10.79 42.55,10.16 v40.01,7.62 | C26.- 44.45,72.39 44.45,28.57 45.09,27.94 45.09,13.34 42.55,10.79
  Bottom 0.635: R45.1 170.18,71.12 163.83,71.12 | R44.2 163.83,71.12 | EDGE.BB2 8.26,77.47 24.13,77.47 24.77,78.11 38.74,78.11 C26.- 43.18,78.74 64.77,78.74 66.04,77.47 163.83,77.47 163.83,71.12 | v40.01,7.62 8.26,7.62 EDGE.AB2
AK1  (via drill 0.81)
  Top 0.406: v52.07,26.67 D1.C | v15.88,27.94 14.61,29.21 8.26,29.21 EDGE.AK1
  Bottom 0.406: D1.C 66.04,17.78 D2.A 76.2,17.78 R1.1 | v52.07,26.67 17.15,26.67 v15.88,27.94
AL1  (via drill 0.81)
  Top 0.406: D8.A R4.1 | v59.69,29.21 D7.C | v15.88,31.11 14.61,32.38 8.26,32.38 EDGE.AL1
  Bottom 0.406: D7.C 66.04,35.56 D8.A | v59.69,29.21 17.78,29.21 v15.88,31.11
AM1  (via drill 0.81)
  Top 0.406: D10.A R5.1 | v19.05,40.64 14.61,36.2 8.26,36.2 EDGE.AM1
  Bottom 0.406: D10.A 66.04,40.64 D9.C 60.96,40.64 v19.05,40.64
AN1  (via drill 0.81)
  Top 0.406: D12.A R6.1 | v18.42,43.18 14.61,39.37 8.26,39.37 EDGE.AN1
  Bottom 0.406: D12.A 66.04,45.72 D11.C v18.42,43.18
AP1  (via drill 0.81)
  Top 0.406: D14.A R7.1 | v27.31,48.26 23.5,44.45 15.24,44.45 15.24,43.18 14.61,42.55 8.26,42.55 EDGE.AP1
  Bottom 0.406: D14.A 66.04,50.8 D13.C 60.96,50.8 37.47,50.8 36.2,52.07 33.02,52.07 29.21,48.26 v27.31,48.26
AR1  (via drill 0.81)
  Top 0.406: D18.A R9.1 | v19.69,50.8 14.61,45.72 8.26,45.72 EDGE.AR1
  Bottom 0.406: D18.A 66.04,60.96 D17.C 62.23,57.15 48.26,57.15 45.72,54.61 38.74,54.61 36.2,57.15 29.85,57.15 23.5,50.8 v19.69,50.8
BAC2D  (via drill 0.81)
  Top 0.406: E1.12 139.7,91.44 E1.2 | E6.2 74.93,128.27 82.55,128.27 82.55,83.19 83.19,82.55 v91.44,82.55
  Bottom 0.406: v91.44,82.55 93.98,85.09 125.73,85.09 128.27,87.63 | E1.9 128.27,87.63 | E1.12 135.89,87.63 128.27,87.63
BD2  (via drill 0.81)
  Top 0.406: E3.1 104.14,109.22 104.14,106.05 102.87,104.78 v102.87,88.9
  Bottom 0.406: v102.87,88.9 73.03,88.9 70.49,86.36 19.05,86.36 18.42,85.72 16.51,85.72 14.61,83.82 8.26,83.82 EDGE.BD2
BE2  (via drill 0.81)
  Top 0.406: v97.16,123.19 100.33,120.02 100.33,113.03 E3.3 | v17.78,87 22.23,82.55 22.23,76.83 24.77,74.3 30.48,74.3 30.48,118.75 37.47,125.73 63.5,125.73 E6.6
  Bottom 0.406: E6.6 67.31,123.19 v97.16,123.19 | v17.78,87 8.26,87 EDGE.BE2
D2AC
  Top 0.406: E9.2 E9.13
  Bottom 0.406: E8.13 144.78,124.46 170.18,124.46 171.45,125.73 | E9.5 171.45,125.73 | E9.2 179.07,125.73 171.45,125.73
D2DATA  (via drill 0.81)
  Top 0.406: 168.91,115.57 E9.10 | v168.91,92.08 168.91,115.57 | E3.2 106.05,113.67 v106.05,115.57 | v166.37,115.57 168.91,115.57 | EDGE.BE1 8.26,87 15.88,87 16.51,87.63 16.51,95.25 17.78,96.52 17.78,118.75 20.32,121.28 20.32,129.54 29.21,129.54 29.85,128.91 29.85,127 E6.7 60.96,130.18 v66.04,130.18
  Bottom 0.406: E2.12 176.53,90.17 173.99,90.17 E2.10 172.09,88.9 v168.91,92.08 | v106.05,115.57 107.32,116.84 134.62,116.84 135.89,118.11 | 135.89,118.11 E8.12 130.81,125.73 113.67,125.73 109.22,130.18 v66.04,130.18 | v166.37,115.57 138.43,115.57 135.89,118.11
GND  (via drill 0.81)
  Top 0.635: C26.+ 23.5,78.11 v23.5,80.64 29.21,86.36 29.21,124.46 v27.94,125.73 | v20.96,71.75 20.96,60.96 | 20.96,60.96 20.96,52.07 8.26,52.07 EDGE.AT1 | v16.51,125.73 16.51,121.92 8.26,121.92 EDGE.BT1 | C22.2 C28.2 81.28,76.2 D24.A D20.C 62.23,64.77 62.23,59.69 | D44.C 39.37,62.23 39.37,67.31 C25.- | C27.2 62.23,59.69 | 62.23,59.69 D18.C | 62.23,35.56 55.88,35.56 C29.2 | 62.23,35.56 D8.C | 62.23,39.37 D10.C | 62.23,35.56 62.23,39.37 | 62.23,44.45 D12.C | 62.23,39.37 62.23,44.45 | 62.23,44.45 62.23,49.53 D14.C 64.77,52.07 64.77,54.61 D16.C | D2.C 62.23,19.05 62.23,21.59 | D4.C 62.23,21.59 | D6.C 62.23,29.21 62.23,21.59 | C23.- v34.29,21.59 | v18.42,10.79 20.96,13.34 v20.96,22.23 | v24.13,60.96 20.96,60.96 | Q10.1 107.95,62.23 107.95,54.61 Q8.1 105.41,52.07 105.41,27.94 | 105.41,27.94 Q3.1 | 105.41,27.94 105.41,24.13 Q2.1 | Q13.1 153.67,16.51 153.67,31.75 Q16.1 | Q22.1 153.67,67.31 153.67,52.07 Q19.1 | C7.2 110.49,124.46 110.49,114.94 111.76,113.67 C3.2 | C9.2 186.69,124.46 186.69,111.76 C5.2 186.69,109.22 186.69,96.52 C2.2 | 146.05,96.52 C1.2 | 146.05,107.95 146.05,109.22 C4.2 | 146.05,107.95 146.05,96.52 | 146.05,107.95 143.51,110.49 | 143.51,110.49 E4.1 | C8.2 143.51,121.92 143.51,110.49 | E2.7 166.37,97.79 166.37,110.49 E5.7 | Q21.1 146.05,68.58 146.05,96.52
  Bottom 0.635: v23.5,80.64 8.26,80.64 EDGE.BC2 | C26.+ v20.96,71.75 | v27.94,125.73 v16.51,125.73 | C27.2 58.42,55.88 D16.C | C25.- 43.18,66.04 D20.C | E10.7 52.07,31.75 C29.2 57.15,30.48 62.23,30.48 | C23.- 43.18,17.78 D2.C | v34.29,21.59 26.67,21.59 C24.+ 21.59,22.86 v20.96,22.23 | v18.42,10.79 8.26,10.79 EDGE.AC2 | D6.C 62.23,30.48 | D44.C v24.13,60.96 | Q20.1 Q21.1 Q22.1 | 133.35,50.8 Q18.1 Q19.1 | 133.35,50.8 Q17.1 | Q11.1 Q12.1 Q13.1 | 133.35,33.02 Q15.1 Q16.1 | 133.35,33.02 Q14.1 | 133.35,33.02 133.35,44.45 | 133.35,44.45 133.35,50.8 | Q8.1 110.49,49.53 118.75,49.53 123.83,44.45 133.35,44.45 | E6.1 80.01,127 C6.2 90.17,125.73 E7.7 92.71,125.73 C7.2 | E3.7 92.71,110.49 C3.2 C4.2 166.37,110.49 E5.7 | E2.7 168.91,95.25 C2.2 | E8.1 146.05,127 C8.2 166.37,125.73 E9.7 | E1.7 128.27,95.25 C1.2 | 62.23,30.48 62.23,26.67 95.25,26.67 Q3.1
  pour Bottom (isolate 0.305): 15.24,0 15.24,132.08 214.63,132.08 214.63,0
  pour Top (isolate 0.305): 15.24,0 15.24,132.08 214.63,132.08 214.63,0
N$1
  Bottom 0.406: R4.2 113.67,35.56 115.57,33.66 115.57,31.75 107.95,31.75 Q4.1
N$2
  Top 0.406: E1.8 115.57,77.47 115.57,29.21 R13.1
  Bottom 0.406: R13.1 Q4.3
N$3
  Bottom 0.406: R1.2 91.44,17.78 Q1.1
N$4
  Bottom 0.406: R5.2 91.44,38.1 Q5.1
N$5  (via drill 0.81)
  Top 0.406: v113.03,86.36 113.03,24.13 R12.1
  Bottom 0.406: Q1.3 97.79,24.13 111.13,24.13 112.4,22.86 R12.1 | E1.11 133.35,90.17 116.84,90.17 v113.03,86.36
N$6  (via drill 0.81)
  Top 0.406: E1.3 135.89,95.25 135.89,70.48 132.72,67.31 118.75,67.31 v118.75,47.62
  Bottom 0.406: Q5.3 97.79,41.91 113.03,41.91 | R16.1 113.03,41.91 | 113.03,41.91 v118.75,47.62
N$7
  Bottom 0.406: R6.2 104.14,45.72 Q6.1
N$8  (via drill 0.81)
  Top 0.406: E7.9 92.71,118.11 v92.71,44.45
  Bottom 0.406: R15.1 Q6.3 99.06,38.1 v92.71,44.45
N$9
  Bottom 0.406: R7.2 91.44,48.26 Q7.1
N$10
  Top 0.406: E7.11 95.25,115.57 95.25,54.61 Q7.3
  Bottom 0.406: Q7.3 104.78,53.34 106.05,54.61 113.03,54.61 R18.1
N$11
  Bottom 0.406: R9.2 91.44,58.42 Q9.1
N$12
  Top 0.406: E7.13 110.49,113.03 110.49,90.81 114.3,87 R20.1
  Bottom 0.406: Q9.3 97.79,64.77 113.03,64.77 R20.1
N$13  (via drill 0.81)
  Top 0.406: v99.06,115.57 E3.4
  Bottom 0.406: v99.06,115.57 101.6,118.11 133.35,118.11 E8.11
N$14  (via drill 0.81)
  Top 0.406: v52.07,41.91 D15.C
  Bottom 0.406: D15.C 66.04,55.88 D16.A 76.2,55.88 D25.C | v52.07,41.91 8.26,41.91 EDGE.AP2
N$15  (via drill 0.81)
  Top 0.406: E8.9 E8.10 135.89,115.57 135.89,102.87 E1.1 | v73.66,104.14 74.93,105.41 v74.93,124.46
  Bottom 0.406: v73.66,104.14 37.47,104.14 35.56,106.05 8.26,106.05 EDGE.BM2 | v74.93,124.46 124.46,124.46 E8.9
N$16  (via drill 0.81)
  Top 0.406: E6.9 E6.10 v66.04,114.3 66.04,107.31 v61.6,102.87 | E1.10 128.27,92.71 128.27,99.06 124.46,102.87 v124.46,111.76
  Bottom 0.406: v124.46,111.76 121.92,114.3 v66.04,114.3 | v61.6,102.87 8.26,102.87 EDGE.BL2
N$17  (via drill 0.81)
  Top 0.406: E1.13 143.51,92.71 143.51,106.05 138.43,111.12 138.43,123.19 E8.4 E8.5 132.08,128.27 126.37,128.27 121.92,123.83 121.92,101.6 v116.84,96.52 | v25.4,97.79 27.94,97.79 v27.94,96.52
  Bottom 0.406: v25.4,97.79 20.96,97.79 19.69,99.06 8.26,99.06 EDGE.BK2 | v116.84,96.52 v27.94,96.52
N$18  (via drill 0.81)
  Top 0.406: E7.12 102.87,118.11 v102.87,109.22 | v24.13,96.52 v24.13,113.03
  Bottom 0.406: v102.87,109.22 72.39,109.22 68.58,113.03 v24.13,113.03 | v24.13,96.52 8.26,96.52 EDGE.BJ2
N$19  (via drill 0.81)
  Top 0.406: v39.37,116.2 35.56,112.39 v35.56,95.25
  Bottom 0.406: E7.10 93.35,116.2 v39.37,116.2 | v35.56,95.25 33.66,93.34 8.26,93.34 EDGE.BH2
N$20  (via drill 0.81)
  Top 0.406: E7.8 88.9,116.84 v88.9,105.41 | v21.59,99.06 17.78,95.25 v17.78,90.17
  Bottom 0.406: v88.9,105.41 86.36,102.87 69.22,102.87 65.41,99.06 v21.59,99.06 | v17.78,90.17 8.26,90.17 EDGE.BF2
N$21  (via drill 0.81)
  Top 0.406: v162.56,96.52 162.56,116.2 171.45,125.09 | 171.45,125.09 172.09,125.73 175.26,125.73 E9.4 | E8.3 138.43,128.27 171.45,128.27 171.45,125.09
  Bottom 0.406: v162.56,96.52 E2.9
N$22  (via drill 0.81)
  Top 0.406: v185.42,93.98 185.42,124.46 E9.1 | E6.14 81.28,114.3 v81.28,101.6
  Bottom 0.406: v185.42,93.98 184.79,93.34 | 184.79,93.34 E2.13 | v81.28,101.6 82.55,100.33 161.93,100.33 168.91,93.34 184.79,93.34
N$23
  Bottom 0.406: E8.14 143.51,118.11 168.91,118.11 | E9.9 168.91,118.11 | E9.12 176.53,118.11 168.91,118.11
N$24
  Bottom 0.406: D27.A 90.17,52.07 100.97,52.07 | 100.97,52.07 102.87,52.07 Q8.2 | R46.1 113.03,46.99 106.05,46.99 100.97,52.07
N$25
  Bottom 0.406: D26.C 81.28,58.42 D25.A
N$26
  Bottom 0.406: R37.1 C18.1 179.07,52.07 193.04,52.07 193.04,122.56 186.06,129.54 172.72,129.54 E9.6
N$27
  Bottom 0.406: Q17.2 142.88,53.34 144.15,54.61 161.29,54.61 R37.2 170.18,53.34 R38.1 180.34,55.88 C18.2
N$28  (via drill 0.81)
  Top 0.406: Q17.3 133.35,54.61 v133.35,8.89 | v38.74,8.89 27.31,20.32 27.31,23.5 25.4,25.4 19.05,25.4 19.05,24.77 14.61,20.32 8.26,20.32 EDGE.AF1
  Bottom 0.406: v38.74,8.89 v133.35,8.89
N$29  (via drill 0.81)
  Top 0.406: v167.64,49.53 E2.8
  Bottom 0.406: C17.1 R35.1 168.91,48.26 v167.64,49.53
N$30
  Bottom 0.406: Q19.2 157.48,53.34 R35.2 165.1,50.8 R36.1 180.34,50.8 C17.2
N$31  (via drill 0.81)
  Top 0.406: D52.C 126.37,60.33 v126.37,17.78 | v22.23,20.95 v30.48,12.7
  Bottom 0.406: D52.C 135.89,57.15 151.13,57.15 Q19.3 | v126.37,17.78 121.29,12.7 v30.48,12.7 | v22.23,20.95 15.24,20.95 14.61,20.32 8.26,20.32 EDGE.AF2
N$32  (via drill 0.81)
  Top 0.406: v171.45,100.33 171.45,24.13 R25.1
  Bottom 0.406: C12.1 R25.1 | v171.45,100.33 E5.11
N$33
  Bottom 0.406: Q11.2 139.7,22.86 R25.2 170.18,22.86 R26.1 180.34,25.4 C12.2
N$34  (via drill 0.81)
  Top 0.406: D45.C 130.81,8.89 130.81,19.05 Q11.3 | v16.51,5.08 14.61,6.99 8.26,6.99 EDGE.AB1
  Bottom 0.406: D45.C 127,5.08 v16.51,5.08
N$35  (via drill 0.81)
  Top 0.406: v163.83,104.14 163.83,29.84 172.09,21.59 173.99,21.59 173.99,26.04 172.72,27.3 R27.1
  Bottom 0.406: C13.1 R27.1 | v163.83,104.14 E5.8
N$36
  Bottom 0.406: C13.2 180.34,30.48 R28.1 165.1,30.48 R27.2 156.21,34.29 146.05,34.29 Q15.2
N$37  (via drill 0.81)
  Top 0.406: D50.C 138.43,26.67 138.43,24.77 139.07,24.13 | 139.07,24.13 140.97,24.13 140.97,36.83 Q15.3 | v134.62,19.68 139.07,24.13 | v15.88,12.06 14.61,13.34 8.26,13.34 EDGE.AD1
  Bottom 0.406: v134.62,19.68 126.37,11.43 28.58,11.43 27.31,10.16 20.96,10.16 19.05,12.06 v15.88,12.06
N$38  (via drill 0.81)
  Top 0.406: E5.13 E5.12 | v50.8,124.46 57.15,118.11 57.15,100.97 v78.11,80.01
  Bottom 0.406: E8.2 139.7,120.65 139.07,120.65 138.43,120.02 138.43,116.84 177.17,116.84 181.61,112.39 181.61,106.68 | 181.61,106.68 181.61,104.14 E5.13 | v50.8,124.46 8.26,124.46 EDGE.BU2 | v78.11,80.01 179.71,80.01 189.23,89.53 189.23,106.68 181.61,106.68
N$39
  Top 0.406: E5.9 E5.10
  Bottom 0.406: E4.14 143.51,102.87 168.91,102.87 E5.9
N$40  (via drill 0.81)
  Top 0.406: E8.6 E8.7 123.19,123.19 v123.19,96.52 | v68.58,93.98 58.42,104.14 v58.42,123.19 | v15.24,123.19 15.24,123.83 14.61,124.46 8.26,124.46 EDGE.BU1
  Bottom 0.406: v123.19,96.52 121.92,95.25 74.3,95.25 73.03,93.98 v68.58,93.98 | v15.24,123.19 v58.42,123.19
N$41  (via drill 0.81)
  Top 0.406: E4.10 E4.9 | v120.02,101.6 115.57,97.16 v115.57,93.98 | v27.31,91.44 22.86,95.89 v22.86,108.58
  Bottom 0.406: E4.9 129.54,101.6 v120.02,101.6 | v115.57,93.98 113.03,91.44 v27.31,91.44 | v22.86,108.58 8.26,108.58 EDGE.BN2
N$42
  Bottom 0.406: R39.1 C19.1 179.07,57.15 191.77,57.15 191.77,120.02 183.52,128.27 179.07,128.27 E9.3
N$43
  Bottom 0.406: 165.1,60.96 R39.2 | 165.1,60.96 R40.1 180.34,60.96 C19.2 | Q21.2 146.05,69.85 154.31,69.85 161.93,62.23 163.83,62.23 165.1,60.96
N$44  (via drill 0.81)
  Top 0.406: v91.44,74.93 90.17,73.66 90.17,50.16 v76.84,36.83 | v29.21,39.37 16.51,26.67 8.26,26.67 EDGE.AJ1
  Bottom 0.406: Q21.3 140.97,74.93 v91.44,74.93 | v76.84,36.83 57.79,36.83 55.25,39.37 v29.21,39.37
N$45
  Top 0.406: E2.11 175.26,45.72 C16.1
  Bottom 0.406: C16.1 R33.1
N$46
  Bottom 0.406: C16.2 180.34,45.72 R34.1 165.1,45.72 R33.2 153.67,52.07 146.05,52.07 Q18.2
N$47  (via drill 0.81)
  Top 0.406: D53.C 127.64,43.81 v127.64,22.86 | v42.55,24.13 41.28,25.4 v34.29,25.4
  Bottom 0.406: D53.C 129.54,54.61 140.97,54.61 Q18.3 | v127.64,22.86 126.37,21.59 92.08,21.59 89.54,24.13 v42.55,24.13 | v34.29,25.4 15.24,25.4 14.61,26.04 8.26,26.04 EDGE.AJ2
N$48
  Top 0.406: E9.11 176.53,118.11 176.53,69.85 C21.1
  Bottom 0.406: C21.1 R43.1
N$49
  Bottom 0.406: C21.2 180.34,71.12 R44.1 171.45,69.85 163.83,69.85 R43.2 158.75,72.39 135.89,72.39 Q20.2
N$50  (via drill 0.81)
  Top 0.406: v31.75,65.41 31.12,64.77 31.12,38.73 15.88,23.5 8.26,23.5 EDGE.AH1
  Bottom 0.406: Q20.3 88.27,73.66 87,74.93 66.68,74.93 64.14,77.47 44.45,77.47 32.39,65.41 v31.75,65.41
N$51  (via drill 0.81)
  Top 0.406: E9.8 165.1,116.84 v165.1,63.5
  Bottom 0.406: C20.1 R41.1 v165.1,63.5
N$52
  Bottom 0.406: Q22.2 161.29,64.77 | 161.29,64.77 R41.2 | 161.29,64.77 171.45,64.77 R42.1 180.34,66.04 C20.2
N$53  (via drill 0.81)
  Top 0.406: Q22.3 151.13,72.39 151.13,52.07 D51.C 143.51,44.45 143.51,5.08 40.64,5.08 23.5,22.23 v23.5,24.13
  Bottom 0.406: v23.5,24.13 20.96,24.13 20.32,23.5 8.26,23.5 EDGE.AH2
N$54  (via drill 0.81)
  Top 0.406: E2.6 170.18,90.81 168.91,89.53 v168.91,39.37
  Bottom 0.406: C15.1 R31.1 170.18,38.1 v168.91,39.37
N$55
  Bottom 0.406: C15.2 180.34,40.64 R32.1 165.1,40.64 R31.2 161.29,36.83 135.89,36.83 Q14.2
N$56  (via drill 0.81)
  Top 0.406: D48.C 129.54,18.41 119.38,8.26 v119.38,7.62 | v18.42,6.35 17.15,7.62 17.15,13.97 14.61,16.51 8.26,16.51 EDGE.AE1
  Bottom 0.406: D48.C 129.54,38.1 Q14.3 | v119.38,7.62 41.91,7.62 40.64,6.35 v18.42,6.35
N$57
  Top 0.406: C11.1 175.26,17.78 | 175.26,17.78 R23.1 | E5.6 173.99,107.95 173.99,27.3 175.26,26.04 175.26,17.78
N$58
  Bottom 0.406: Q13.2 R23.2 165.1,20.32 R24.1 180.34,20.32 C11.2
N$59  (via drill 0.81)
  Top 0.406: Q13.3 151.13,19.05 151.13,11.43 D46.C 140.97,1.27 26.67,1.27 v26.67,11.43
  Bottom 0.406: v26.67,11.43 24.77,13.34 8.26,13.34 EDGE.AD2
N$60
  Top 0.406: E2.3 179.07,95.25 179.07,34.29 C14.1
  Bottom 0.406: C14.1 R29.1
N$61
  Bottom 0.406: Q16.2 160.02,35.56 R29.2 165.1,35.56 R30.1 180.34,35.56 C14.2
N$62
  Top 0.406: D49.C 151.13,29.21 151.13,36.83 Q16.3
  Bottom 0.406: D49.C 146.05,24.13 112.4,24.13 111.13,25.4 40.64,25.4 34.93,19.68 17.15,19.68 14.61,17.14 8.26,17.14 EDGE.AE2
N$63
  Top 0.406: R21.1 C10.1 181.61,16.51 181.61,107.95 E5.3
N$64
  Bottom 0.406: C10.2 180.34,15.24 R22.1 165.1,15.24 R21.2 158.75,16.51 146.05,16.51 Q12.2
N$65  (via drill 0.81)
  Top 0.406: D47.C 140.97,13.97 140.97,19.05 Q12.3 | v20.96,8.89 19.69,7.62 19.69,1.91 19.05,1.27 16.51,1.27 16.51,3.17 15.88,3.81 8.26,3.81 EDGE.AA1
  Bottom 0.406: D47.C 28.58,10.16 27.31,8.89 v20.96,8.89
N$66
  Bottom 0.406: E2.4 E2.5 167.64,101.6 142.24,101.6 E4.13
N$67
  Top 0.406: E5.5 E5.4
  Bottom 0.406: E4.2 140.97,113.03 171.45,113.03 E5.5
N$68
  Top 0.406: E5.1 E5.2 179.07,113.03 179.07,123.83 176.53,126.36 176.53,127.64 172.72,131.44 19.05,131.44 19.05,128.91 18.42,128.27 8.26,128.27 EDGE.BV1
N$69
  Bottom 0.406: E2.1 E2.2 179.07,96.52 179.07,112.39 177.17,114.3 139.7,114.3 E4.3
N$70  (via drill 0.81)
  Top 0.406: E4.4 E4.5 | v120.65,115.57 113.03,123.19 113.03,126.36 109.86,129.54 67.31,129.54 66.04,128.27 64.77,128.27 64.77,125.73 v59.69,120.65
  Bottom 0.406: E4.5 128.27,115.57 v120.65,115.57 | v59.69,120.65 16.51,120.65 14.61,118.75 8.26,118.75 EDGE.BS2
N$71  (via drill 0.81)
  Top 0.406: E4.7 E4.6 133.35,107.95 v133.35,86.36 | v72.39,81.28 39.37,81.28 v39.37,114.3
  Bottom 0.406: v133.35,86.36 128.27,81.28 v72.39,81.28 | v39.37,114.3 38.74,114.94 8.26,114.94 EDGE.BR2
N$72
  Bottom 0.406: E4.12 E4.11 133.35,105.41 128.91,105.41 128.27,104.78 128.27,102.87 98.43,102.87 97.79,103.5 97.79,107.95 72.39,107.95 68.58,111.76 8.26,111.76 EDGE.BP2
N$73
  Bottom 0.406: D27.C 81.28,55.88 D26.A
N$74  (via drill 0.81)
  Top 0.406: v105.41,101.6 109.22,97.79 109.22,50.8 Q8.3 | D28.A 38.1,60.96 v38.1,105.41
  Bottom 0.406: D28.A 29.85,58.42 23.5,52.07 8.26,52.07 EDGE.AT2 | R17.1 Q8.3 | v105.41,101.6 96.52,101.6 E3.9 91.44,106.68 88.27,106.68 87,105.41 v38.1,105.41
N$75
  Bottom 0.406: D31.A 90.17,62.23 102.87,62.23 Q10.2 115.57,60.96 115.57,57.15 R47.1
N$76
  Bottom 0.406: D30.C 81.28,68.58 D29.A
N$77
  Top 0.406: D31.C 87.63,63.5 87.63,64.77 D30.A
N$78
  Top 0.406: E3.11 100.33,102.87 100.33,66.67 106.68,60.33 Q10.3
  Bottom 0.406: EDGE.AS2 8.26,48.9 14.61,48.9 15.24,49.53 29.21,49.53 D32.A 39.37,52.07 85.73,52.07 88.27,54.61 102.87,54.61 Q10.3 R19.1
N$79
  Top 0.406: Q2.2 R48.1
  Bottom 0.406: D35.A 90.17,19.05 102.87,19.05 Q2.2
N$80
  Bottom 0.406: D34.C 81.28,22.86 D33.A
N$81
  Bottom 0.406: D35.C 81.28,20.32 D34.A
N$82  (via drill 0.81)
  Top 0.406: R11.1 Q2.3 | D36.A 39.37,44.45 39.37,31.75 E10.3 43.82,27.3 v43.82,13.97
  Bottom 0.406: Q2.3 102.87,13.97 v43.82,13.97
N$83
  Bottom 0.406: D39.A 91.44,30.48 Q3.2 100.33,29.21 113.03,29.21 R49.1
N$84
  Bottom 0.406: D38.C 81.28,33.02 D37.A
N$85
  Bottom 0.406: D39.C 81.28,30.48 D38.A
N$86
  Top 0.406: E10.1 34.29,31.75 34.29,49.53 D40.A
  Bottom 0.406: R14.1 113.03,34.29 97.79,34.29 Q3.3 95.25,34.29 87,34.29 74.3,46.99 39.37,46.99 D40.A
N$87  (via drill 0.81)
  Top 0.406: E10.4 40.64,33.02 v40.64,35.56
  Bottom 0.406: v40.64,35.56 17.78,35.56 14.61,38.73 8.26,38.73 EDGE.AN2
N$88  (via drill 0.81)
  Top 0.406: E3.8 87,99.69 v87,85.09 | v15.88,78.74 14.61,77.47 8.26,77.47 EDGE.BB1
  Bottom 0.406: v87,85.09 84.46,82.55 71.76,82.55 70.49,81.28 26.04,81.28 23.5,78.74 v15.88,78.74
N$89  (via drill 0.81)
  Top 0.406: v96.52,87.63 E3.10 | v18.42,84.45 17.78,83.82 17.78,77.47 14.61,74.3 8.26,74.3 EDGE.BA1
  Bottom 0.406: v96.52,87.63 95.25,86.36 71.76,86.36 70.49,85.09 19.05,85.09 v18.42,84.45
N$90  (via drill 0.81)
  Top 0.406: v15.88,35.56 v18.42,33.02
  Bottom 0.406: E10.2 35.56,33.02 v18.42,33.02 | v15.88,35.56 8.26,35.56 EDGE.AM2
N$91  (via drill 0.81)
  Top 0.406: v28.58,128.27 19.05,118.75 v19.05,104.78 | v15.88,104.14 14.61,102.87 8.26,102.87 EDGE.BL1
  Bottom 0.406: E6.5 64.77,128.27 v28.58,128.27 | v19.05,104.78 18.42,104.14 v15.88,104.14
N$92  (via drill 0.81)
  Top 0.406: E6.4 67.31,125.73 v67.31,102.87 | v15.88,100.97 14.61,99.69 8.26,99.69 EDGE.BK1
  Bottom 0.406: v67.31,102.87 65.41,100.97 v15.88,100.97
N$93  (via drill 0.81)
  Top 0.406: E6.3 69.85,125.73 v69.85,107.31 | v15.88,107.31 14.61,106.05 8.26,106.05 EDGE.BM1
  Bottom 0.406: v15.88,107.31 v69.85,107.31
N$94  (via drill 0.81)
  Top 0.406: v55.88,87.63 v55.88,117.47 | v15.24,88.27 15.24,88.9 14.61,89.53 8.26,89.53 EDGE.BF1
  Bottom 0.406: E6.13 71.76,117.47 v55.88,117.47 | v55.88,87.63 19.05,87.63 18.42,88.27 v15.24,88.27
N$95  (via drill 0.81)
  Top 0.406: v71.12,88.9 E6.12 | v15.24,91.44 15.24,92.08 14.61,92.71 8.26,92.71 EDGE.BH1
  Bottom 0.406: v71.12,88.9 20.96,88.9 18.42,91.44 v15.24,91.44
N$96  (via drill 0.81)
  Top 0.406: v68.58,100.33 E6.11 | v15.24,94.61 15.24,95.25 14.61,95.89 8.26,95.89 EDGE.BJ1
  Bottom 0.406: v68.58,100.33 66.04,97.79 27.31,97.79 24.13,94.61 v15.24,94.61
N$97  (via drill 0.81)
  Top 0.406: E1.5 125.73,102.87 v125.73,120.65 | v18.42,121.92 15.24,118.75 8.26,118.75 EDGE.BS1
  Bottom 0.406: v125.73,120.65 124.46,121.92 v18.42,121.92
N$98  (via drill 0.81)
  Top 0.406: v72.39,95.25 v74.93,97.79 | v54.61,95.25 40.64,109.22 40.64,116.84 39.37,118.11 v31.75,118.11 | v16.51,118.11 15.24,116.84 15.24,116.2 14.61,115.57 8.26,115.57 EDGE.BR1
  Bottom 0.406: E1.6 128.27,97.79 v74.93,97.79 | v54.61,95.25 v72.39,95.25 | v16.51,118.11 v31.75,118.11
N$99  (via drill 0.81)
  Top 0.406: v76.84,99.06 72.39,103.5 v72.39,106.68 | v27.94,109.22 25.4,111.76 R51.1 | v16.51,116.2 16.51,112.39 8.26,112.39 EDGE.BP1
  Bottom 0.406: E1.4 132.08,99.06 v76.84,99.06 | v72.39,106.68 69.85,109.22 v27.94,109.22 | v16.51,116.2 17.15,116.84 R51.1
N$100  (via drill 0.81)
  Top 0.406: E3.6 93.98,115.57 95.25,116.84 95.25,120.65 | 95.25,120.65 95.25,125.73 E7.5 | 95.25,120.65 83.82,120.65 v83.82,83.82 | v15.24,81.92 15.24,81.28 14.61,80.64 8.26,80.64 EDGE.BC1
  Bottom 0.406: v83.82,83.82 71.76,83.82 70.49,82.55 21.59,82.55 20.96,81.92 v15.24,81.92
N$101  (via drill 0.81)
  Top 0.406: v87.63,113.03 85.09,110.49 v85.09,85.09 | v16.51,83.19 8.26,83.19 EDGE.BD1
  Bottom 0.406: E3.5 95.25,113.03 v87.63,113.03 | v85.09,85.09 71.76,85.09 70.49,83.82 21.59,83.82 20.96,83.19 v16.51,83.19
N$102  (via drill 0.81)
  Top 0.406: v104.14,90.17 E3.13 | v33.02,90.17 31.75,88.9 31.75,74.3 30.48,73.03 22.23,73.03 22.23,73.66 21.59,74.3 19.05,74.3 19.05,59.05 18.42,58.42 8.26,58.42 EDGE.AV1
  Bottom 0.406: v33.02,90.17 v104.14,90.17
N$103  (via drill 0.81)
  Top 0.406: v101.6,71.12 E3.12 | v15.88,56.52 14.61,55.24 8.26,55.24 EDGE.AU1
  Bottom 0.406: v101.6,71.12 95.25,64.77 66.68,64.77 64.14,62.23 43.82,62.23 41.28,59.69 19.69,59.69 16.51,56.52 v15.88,56.52
N$104
  Bottom 0.406: E7.6 92.08,128.91 65.41,128.91 64.77,129.54 20.96,129.54 18.42,127 15.24,127 14.61,127.64 8.26,127.64 EDGE.BV2
N$105
  Bottom 0.406: D24.C 66.04,73.66 D23.A
N$106  (via drill 0.81)
  Top 0.406: D4.A D33.C | D3.C 64.77,19.05 64.77,14.61 64.14,13.97 46.36,13.97 v46.36,27.94
  Bottom 0.406: D3.C 66.04,22.86 D4.A | v46.36,27.94 17.78,27.94 16.51,29.21 8.26,29.21 EDGE.AK2
N$107
  Bottom 0.406: D41.C 48.26,53.34 D42.A
N$108
  Bottom 0.406: D42.C 41.91,57.15 46.99,57.15 48.26,58.42 D43.A
N$109
  Bottom 0.406: D43.C 46.99,58.42 49.53,60.96 D44.A
N$110
  Bottom 0.406: D22.C 66.04,68.58 D21.A
N$111  (via drill 0.81)
  Top 0.406: v27.31,62.23 22.23,57.15 v22.23,48.26
  Bottom 0.406: D29.C 76.2,66.04 D20.A 66.04,66.04 D19.C 62.23,64.77 43.82,64.77 41.28,62.23 v27.31,62.23 | v22.23,48.26 19.69,45.72 8.26,45.72 EDGE.AR2
N$112
  Bottom 0.406: 66.04,30.48 D5.C | 66.04,30.48 D6.A 76.2,30.48 D37.C | 66.04,30.48 64.77,31.75 57.79,31.75 55.25,34.29 15.88,34.29 14.61,33.02 8.26,33.02 EDGE.AL2
VCC  (via drill 0.81)
  Top 0.635: C23.+ 22.23,12.06 v22.23,3.81 | v41.91,36.83 41.91,62.23 R50.2 | v31.12,18.41 33.02,20.32 33.02,26.04 36.83,29.84 36.83,36.83 E10.14 | R11.2 R48.2 R12.2 R13.2 R49.2 R14.2 R15.2 R16.2 R46.2 R17.2 R18.2 R47.2 R19.2 R20.2 127.64,63.5 130.18,66.04 140.97,66.04 140.97,87.63 E1.14 | E2.14 184.15,90.17 184.15,102.87 | E5.14 184.15,102.87 | E9.14 184.15,118.11 184.15,102.87 | 148.59,106.68 C4.1 | 148.59,106.68 148.59,119.38 C8.1 | C1.1 148.59,91.44 148.59,106.68 | C3.1 113.03,106.68 113.03,119.38 C7.1 | C25.+ 34.29,68.58 34.29,115.57 R51.2
  Bottom 0.635: v22.23,3.81 8.26,3.81 EDGE.AA2 | E10.14 36.83,36.83 v41.91,36.83 C29.1 | R50.2 40.01,64.14 29.85,64.14 C25.+ 22.23,68.58 17.15,73.66 8.26,73.66 EDGE.BA2 | C23.+ 28.58,18.41 v31.12,18.41 | C9.1 184.15,120.65 E9.14 181.61,120.65 C8.1 | E2.14 184.15,90.17 C2.1 | E5.14 184.15,105.41 C5.1 | E1.14 143.51,90.17 C1.1 | R51.2 38.1,119.38 E6.8 62.23,120.65 C6.1 107.95,120.65 | E3.14 107.95,105.41 C3.1 125.73,105.41 126.37,104.78 | 126.37,104.78 E4.8 | 107.95,120.65 E7.14 E8.8 | C7.1 107.95,120.65 | C4.1 146.05,106.68 128.27,106.68 126.37,104.78

### Text on the board
Bottom: VRS | M7103 NEGATIVE I/O BUS CONVERTER